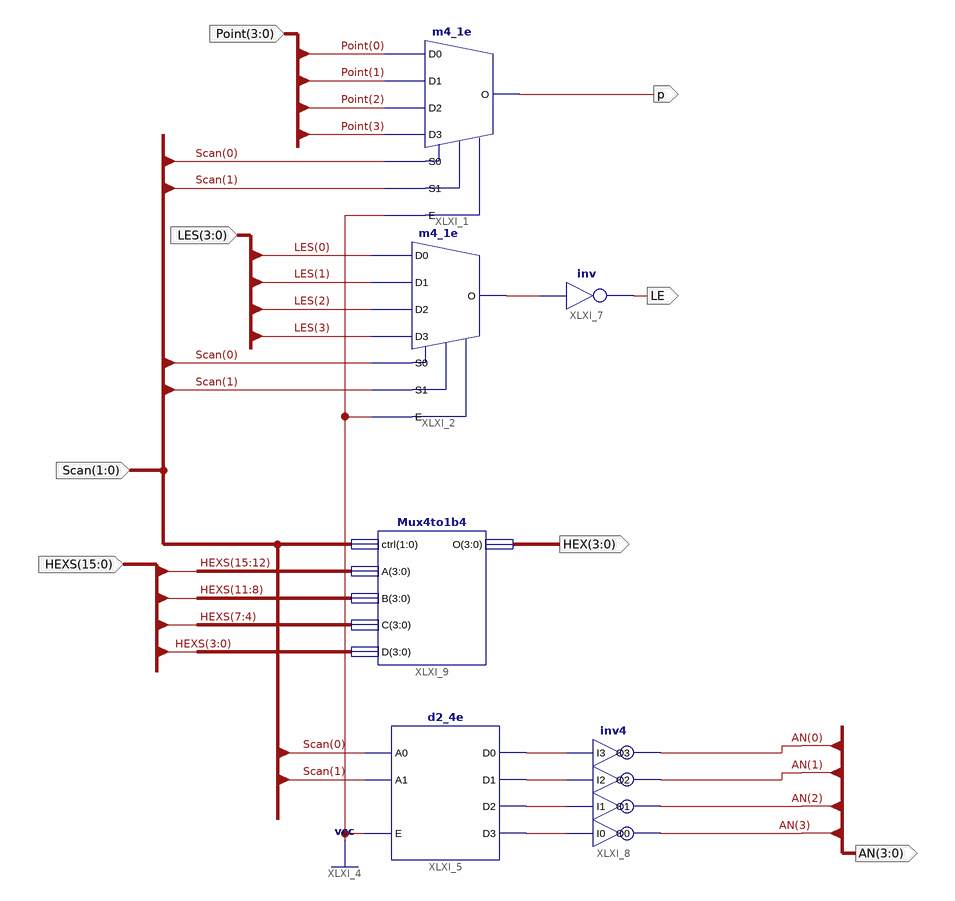
[diagram p0: schematic sheet 1]
// Xilinx ISE schematic DispSync.sch (kintex7) as structural Verilog: 6 symbols, 8 ports
module DispSync (
  input  [1:0] Scan,
  input  [3:0] Point,
  input  [3:0] LES,
  input  [15:0] HEXS,
  output [3:0] HEX,
  output p,
  output LE,
  output [3:0] AN
);

  wire XLXN_62, XLXN_75, XLXN_76, XLXN_77, XLXN_78;

  m4_1e XLXI_1 (
    .D0(Point[0]), .D1(Point[1]), .D2(Point[2]), .D3(Point[3]), .E(1'b1), .S0(Scan[0]), .S1(Scan[1]), .O(p));
  m4_1e XLXI_2 (.D0(LES[0]), .D1(LES[1]), .D2(LES[2]), .D3(LES[3]), .E(1'b1), .S0(Scan[0]), .S1(Scan[1]), .O(XLXN_62));
  d2_4e XLXI_5 (.A0(Scan[0]), .A1(Scan[1]), .E(1'b1), .D0(XLXN_75), .D1(XLXN_76), .D2(XLXN_77), .D3(XLXN_78));
  not XLXI_7 (LE, XLXN_62);
  inv4 XLXI_8 (.I0(XLXN_78), .I1(XLXN_77), .I2(XLXN_76), .I3(XLXN_75), .O0(AN[3]), .O1(AN[2]), .O2(AN[1]), .O3(AN[0]));
  Mux4to1b4 XLXI_9 (.ctrl(Scan), .A(HEXS[15:12]), .B(HEXS[11:8]), .C(HEXS[7:4]), .D(HEXS[3:0]), .O(HEX));
endmodule
